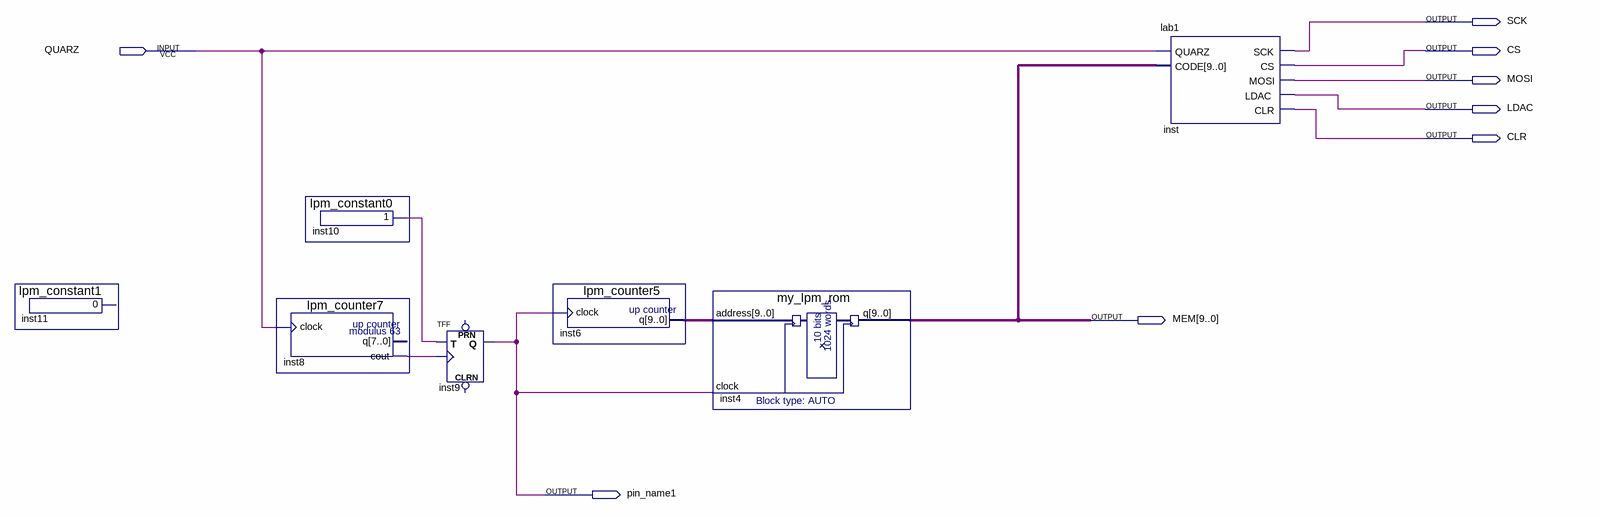
[diagram p0: schematic sheet]
// Quartus schematic sinus.bdf as structural Verilog: 7 symbols, 8 pins
module sinus (
  input  QUARZ,
  output SCK,
  output CS,
  output MOSI,
  output LDAC,
  output CLR,
  output [9:0] MEM,
  output pin_name1
);

  wire inst8_cout, inst10_result;
  wire [9:0] inst6_q;

  lpm_constant1 inst11 ();  // open: result
  lpm_constant0 inst10 (.result(inst10_result));
  lpm_counter7 inst8 (.clock(QUARZ), .cout(inst8_cout));  // open: q
  TFF inst9 (.T(inst10_result), .CLK(inst8_cout), .Q(pin_name1));  // open: PRN, CLRN
  lpm_counter5 inst6 (.clock(pin_name1), .q(inst6_q));
  my_lpm_rom inst4 (.address(inst6_q), .clock(pin_name1), .q(MEM));
  lab1 inst (.QUARZ(QUARZ), .CODE(MEM), .SCK(SCK), .CS(CS), .MOSI(MOSI), .LDAC(LDAC), .CLR(CLR));
endmodule
